# Altium schematic sheet gydrodrive_blockDiagram.SchDoc
size A4; SheetNumber: 1; SheetTotal: 22
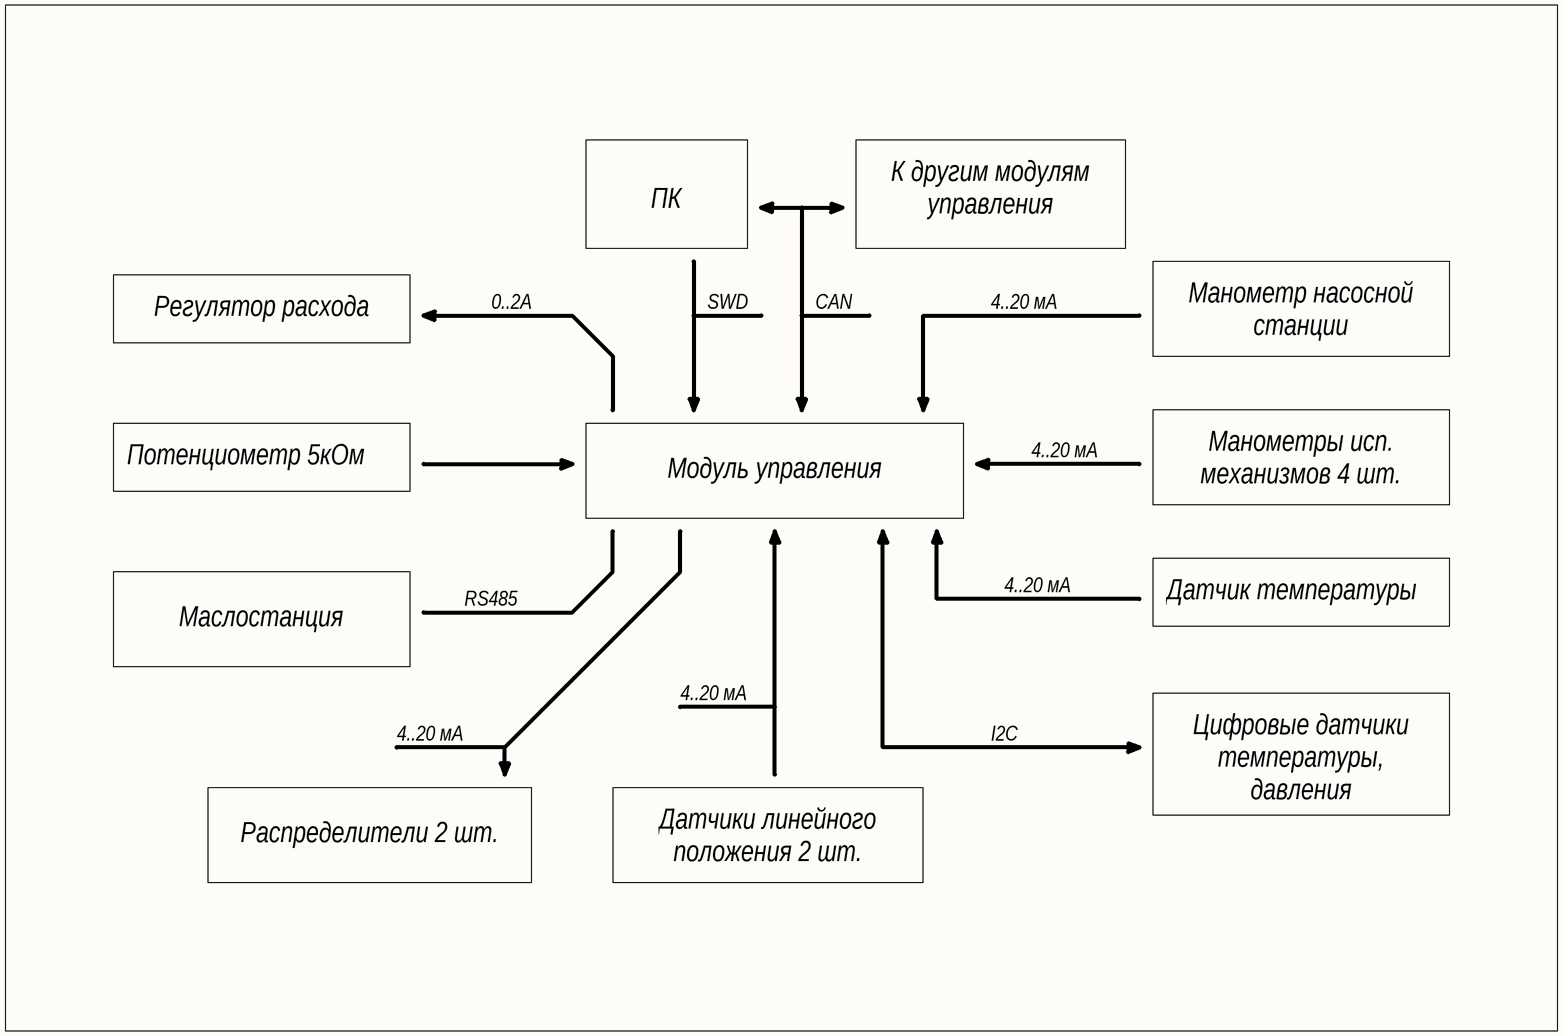
[diagram p0: gydrodrive_blockDiagram.SchDoc]

## Notes on the sheet
- ПК
- К другим модулям управления
- 0..2А
- SWD
- CAN
- 4..20 мА
- Регулятор расхода
- Манометр насосной станции
- Потенциометр 5кОм
- Модуль управления
- Манометры исп. механизмов 4 шт.
- RS485
- Датчик температуры
- Маслостанция
- I2C
- Цифровые датчики температуры, давления
- Распределители 2 шт.
- Датчики линейного положения 2 шт.